# Altium schematic sheet Arduino_三明治开发板_case01.SchDoc
size A3
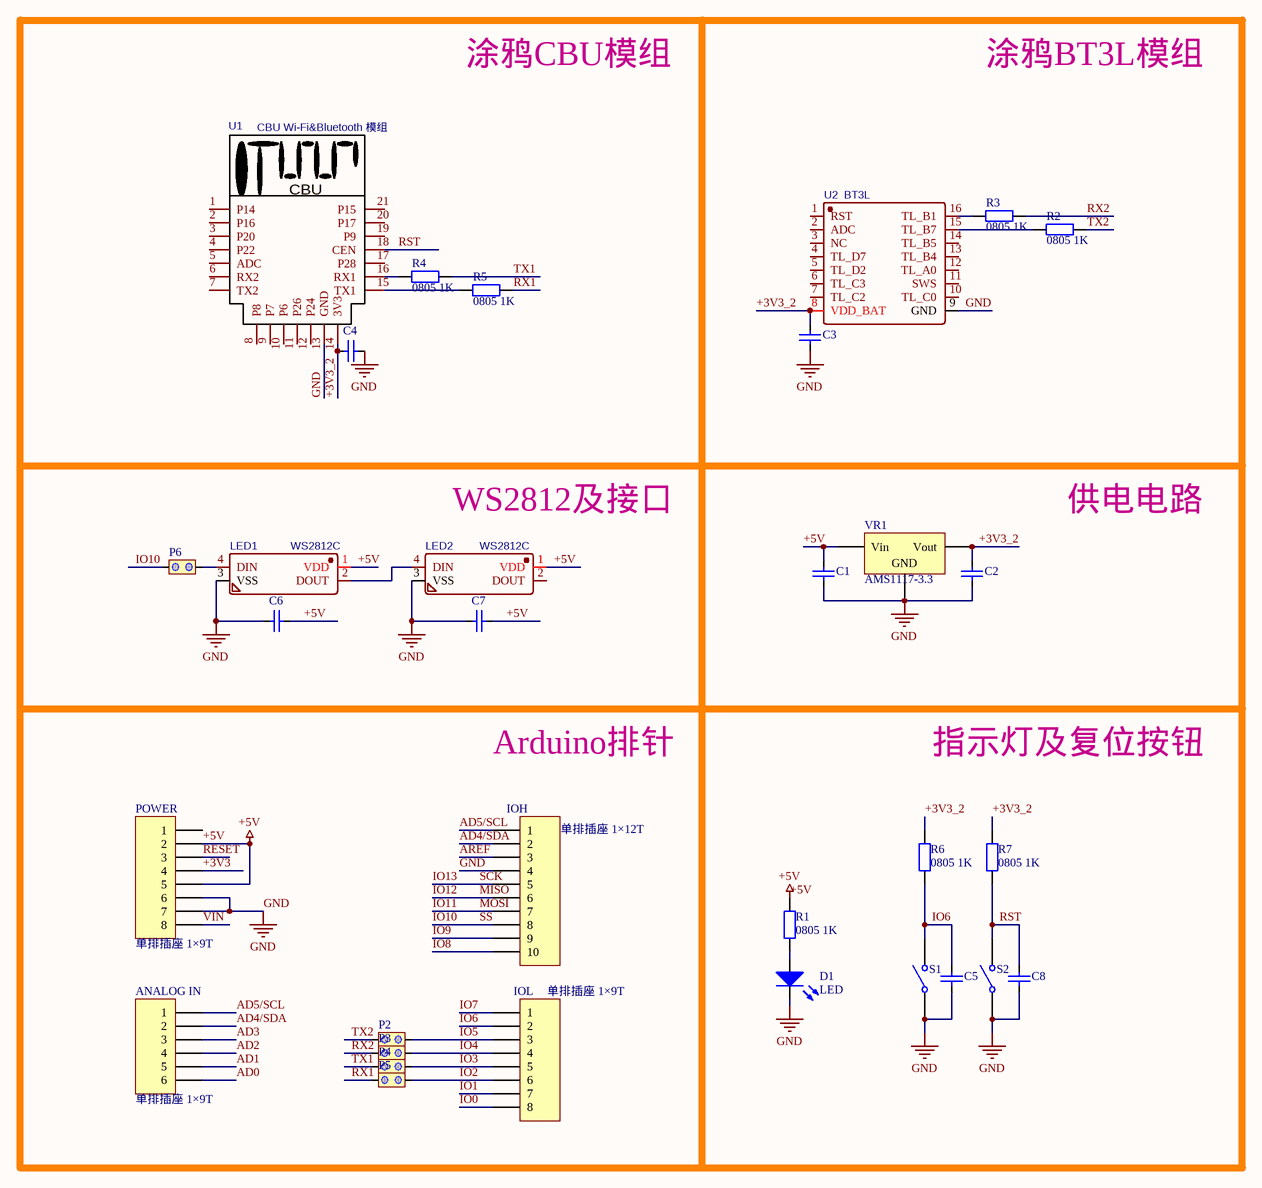
[diagram p0: Arduino_三明治开发板_case01.SchDoc]

## Parts
ANALOG_IN  单排插座 1×9T  [HDR1X6Z]
C1  1206 0.1uF  [0805-CAP-min]  (value not drawn)
C2  1206 0.1uF  [0805-CAP-min]  (value not drawn)
C3  1206 0.1uF  [0805-CAP-min]  (value not drawn)
C4  1206 0.1uF  [0805-CAP-min]  (value not drawn)
C5  1206 0.1uF  [0805-CAP-min]  (value not drawn)
C6  1206 0.1uF  [0805-CAP-min]  (value not drawn)
C7  1206 0.1uF  [0805-CAP-min]  (value not drawn)
C8  1206 0.1uF  [0805-CAP-min]  (value not drawn)
D1  LED  [LED3014-FD]
IOH  单排插座 1×12T  [HDR1X10Z]
IOL  单排插座 1×9T  [HDR1X8Z]
LED1  WS2812C  [LED-SMD_4P-L5.0-W5.0-TL]
LED2  WS2812C  [LED-SMD_4P-L5.0-W5.0-TL]
P2  HDR1*2  [HDR1X2]  (value not drawn)
P3  HDR1*2  [HDR1X2]  (value not drawn)
P4  HDR1*2  [HDR1X2]  (value not drawn)
P5  HDR1*2  [HDR1X2]  (value not drawn)
P6  HDR1*2  [HDR1X2]  (value not drawn)
POWER  单排插座 1×9T  [HDR1X8Z]
R1  0805 1K  [0805-R-min]
R2  0805 1K  [0805-R-min]
R3  0805 1K  [0805-R-min]
R4  0805 1K  [0805-R-min]
R5  0805 1K  [0805-R-min]
R6  0805 1K  [0805-R-min]
R7  0805 1K  [0805-R-min]
S1  SW-SPST  [Switch]  (value not drawn)
S2  SW-SPST  [Switch]  (value not drawn)
U1  CBU Wi-Fi&Bluetooth 模组  [CBU WIFI&BLUETOOTH]
U2  BT3L  [BLUETOOTH-SMD_16P-L24.0-W16.0-P2.0-BT3L]
VR1  AMS1117-3.3  [SOT-223]

## Nets
+5V: C1.1 C6.1 C7.1 LED1.1(VDD) LED2.1(VDD) POWER.2 POWER.5 R1.1 VR1.3(Vin)
GND: C1.2 C2.1 C3.1 C4.1 C5.2 C6.2 C7.2 C8.2 D1.2(K) IOH.4 LED1.3(VSS) LED2.3(VSS) POWER.6 POWER.7 S1.1(COMMON) S2.1(COMMON) U1.13(GND) U2.9(GND) VR1.1(GND)
+3V3: POWER.4
+3V3_2: C2.2 C3.2 C4.2 R6.1 R7.1 U1.14(3V3) U2.8(VDD_BAT) VR1.2(Vout)
AD0: ANALOG_IN.6
AD1: ANALOG_IN.5
AD2: ANALOG_IN.4
AD3: ANALOG_IN.3
AD4/SDA: ANALOG_IN.2 IOH.2
AD5/SCL: ANALOG_IN.1 IOH.1
AREF: IOH.3
IO0: IOL.8
IO1: IOL.7
IO2: IOL.6 P5.2
IO3: IOL.5 P4.2
IO4: IOL.4 P3.2
IO5: IOL.3 P2.2
IO6: C5.1 IOL.2 R6.2 S1.2(NO)
IO7: IOL.1
IO8: IOH.10
IO9: IOH.9
IO10: IOH.8 P6.1  [also labelled SS]
IO11: IOH.7  [also labelled MOSI]
IO12: IOH.6  [also labelled MISO]
IO13: IOH.5  [also labelled SCK]
RESET: POWER.3
RST: C8.1 R7.2 S2.2(NO) U1.18(CEN)
RX1: P5.1 R5.1
RX2: P3.1 R3.1
TX1: P4.1 R4.1
TX2: P2.1 R2.1
VIN: POWER.8
NetD1_1: D1.1(A) R1.2
NetLED1_2: LED1.2(DOUT) LED2.4(DIN)
NetLED1_4: LED1.4(DIN) P6.2
NetR2_2: R2.2 U2.15(TL_B7)
NetR3_2: R3.2 U2.16(TL_B1)
NetR4_2: R4.2 U1.16(RX1)
NetR5_2: R5.2 U1.15(TX1)

Not connected (* = marked no-connect by the designer): LED2 2(DOUT); POWER 1; U1 1(P14) 2(P16) 3(P20) 4(P22) 5(ADC) 6(RX2) 7(TX2) 8(P8) 9(P7) 10(P6) 11(P26) 12(P24) 17(P28) 19(P9) 20(P17) 21(P15); U2 1(RST) 2(ADC) 3(NC) 4(TL_D7) 5(TL_D2) 6(TL_C3) 7(TL_C2) 10(TL_C0) 11(SWS) 12(TL_A0) 13(TL_B4) 14(TL_B5)

## Notes on the sheet
- 涂鸦CBU模组
- 涂鸦BT3L模组
- (near LED2) WS2812及接口
- 供电电路
- Arduino排针
- 指示灯及复位按钮
- (in symbol CBU Wi-Fi&Bluetooth 模组) CBU

## Library data of the parts
ANALOG_IN = Header 6: Header, 6-Pin; LatestRevisionDate: 17-Jul-2002; LatestRevisionNote: Re-released for DXP Platform.; Publisher: Altium Limited
C1-C8 = Cap-1206: Capacitor; Published: 8-Jun-2000; LatestRevisionDate: 17-Jul-2002; LatestRevisionNote: Re-released for DXP Platform.; PackageReference: RAD-0.3; Publisher: Altium Limited
D1 = LED-3014: Published: 8-Jun-2000; LatestRevisionDate: 17-Jul-2002; LatestRevisionNote: Re-released for DXP Platform.; PackageVersion: Feb-2002; PackageReference: 3.2X1.6X1.1; Publisher: Altium Limited
IOH = Header 10: Header, 10-Pin; LatestRevisionDate: 17-Jul-2002; LatestRevisionNote: Re-released for DXP Platform.; Publisher: Altium Limited
IOL POWER = Header 8: Header, 8-Pin; LatestRevisionDate: 17-Jul-2002; LatestRevisionNote: Re-released for DXP Platform.; Publisher: Altium Limited
LED1 LED2 = WS2812C: BOM_Manufacturer: Worldsemi; Contributor: LCSC; SMT Type: Extend; BOM_Supplier: LCSC; BOM_Manufacturer Part: WS2812C; BOM_Supplier Part: C114587; BOM_LCSC Assembly: Yes; spicePre: L; spiceSymbolName: WS2812C
P2-P6 = HDR1*2_2: LatestRevisionDate: 17-Jul-2002; LatestRevisionNote: Re-released for DXP Platform.; Publisher: Altium Limited
R1-R7 = Res-0805: Resistor; Published: 8-Jun-2000; LatestRevisionDate: 17-Jul-2002; LatestRevisionNote: Re-released for DXP Platform.; PackageReference: AXIAL-0.4; Publisher: Altium Limited; Value: 1K
S1 S2 = SW-SPST: Single-Pole, Single-Throw Switch; Published: 24-Mar-1999; LatestRevisionDate: 17-Jul-2002; LatestRevisionNote: Re-released for DXP Platform.; PackageReference: SPST-2; Publisher: Altium Limited
U1 = CBU Wi-Fi&Bluetooth 模组: BOM_Manufacturer: SHOWNAME=F; Contributor: chenlf; BOM_Manufacturer Part: SHOWNAME=F; BOM_Supplier Part: SHOWNAME=F; BOM_Supplier: Tuya; link: SHOWNAME=F; spicePre: U; spiceSymbolName: CBU Wi-Fi&amp;Bluetooth 模组
U2 = BT3L: BOM_Manufacturer: null; Contributor: LCSC; BOM_Supplier: LCSC; BOM_Supplier Part: C2828287; BOM_Manufacturer Part: BT3L; BOM_JLCPCB Part Class: Extended Part; spicePre: U; spiceSymbolName: BT3L
VR1 = SOT-223 AMS1117-3.3: 低压差线性稳压(LDO); ComponentLink1Description: 供应商链接; ComponentLink1URL: http://www.szlcsc.com/product/details_6652.html; Package: SOT-223; Supplier: LC; SuppliersPartNumber: C6186